# EAGLE design dboardv2 (EAGLE 4.16)
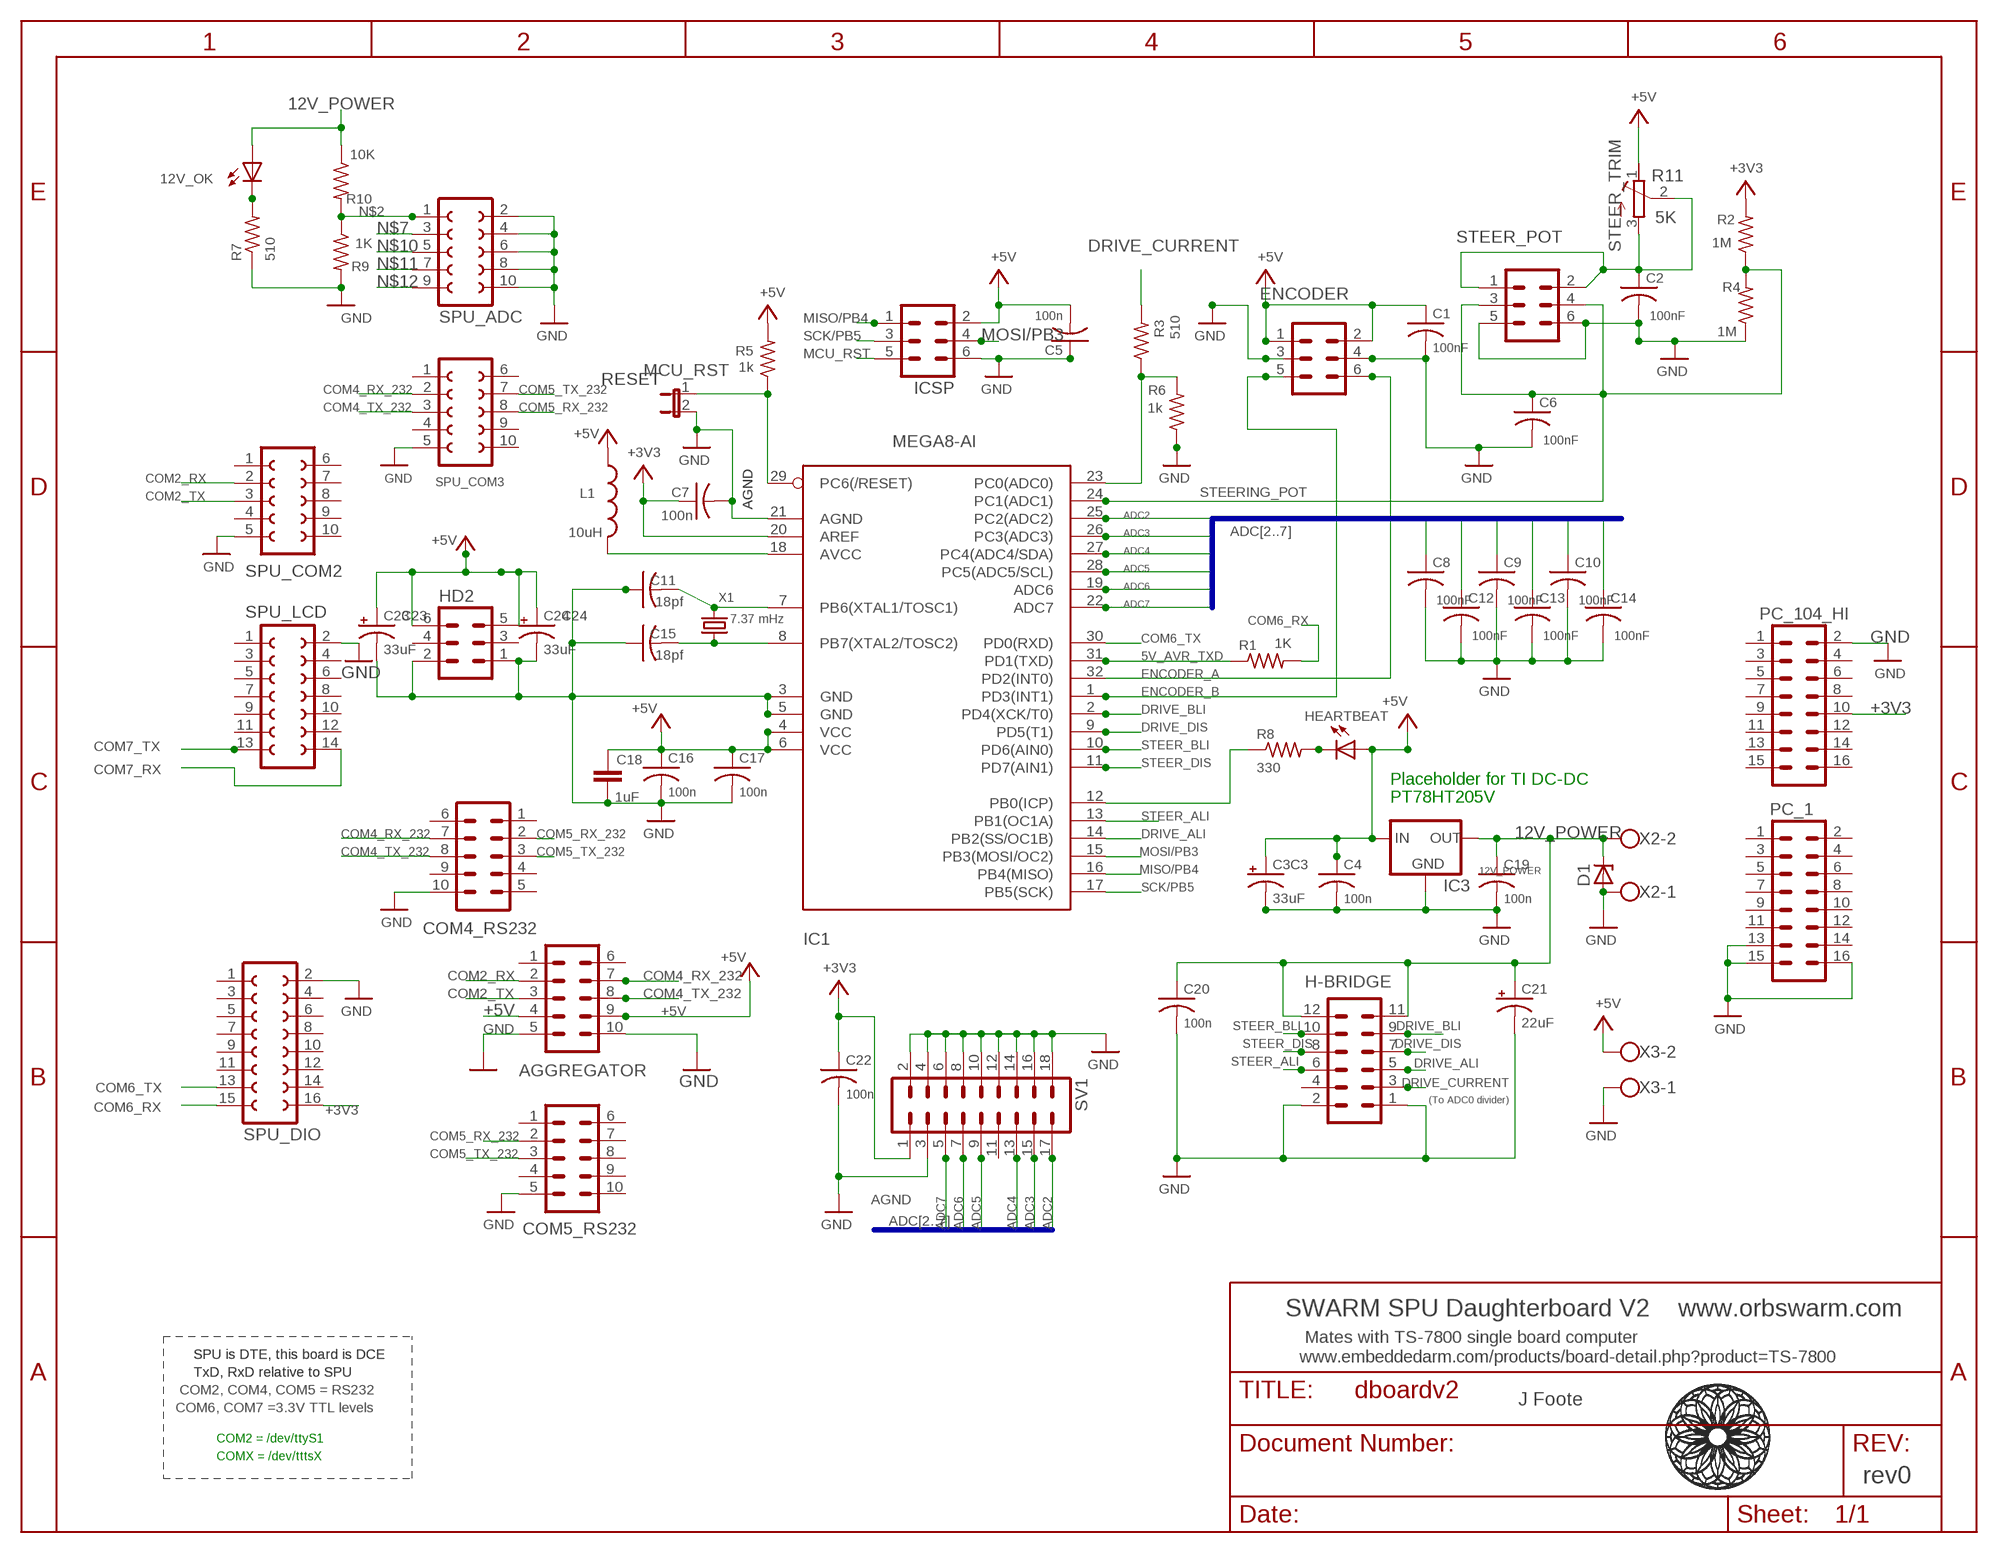
[diagram p0: schematic, sheet 1]

## Parts
12V_OK  LEDSMT1206  [1206]
AGGREGATOR  COMHEADER-M  [MA05-2]
C1  100nF  C-USC1206  [C1206]
C2  100nF  C-USC1206  [C1206]
C3  33uF  CPOL-USCT7343  [CT7343]
C4  100n  C-USC1206  [C1206]
C5  100n  C-USC1206  [C1206]
C6  100nF  C-USC1206  [C1206]
C7  100n  C-USC1206  [C1206]
C8  100nF  C-USC1206  [C1206]
C9  100nF  C-USC1206  [C1206]
C10  100nF  C-USC1206  [C1206]
C11  18pf  C-USC1206  [C1206]
C12  100nF  C-USC1206  [C1206]
C13  100nF  C-USC1206  [C1206]
C14  100nF  C-USC1206  [C1206]
C15  18pf  C-USC1206  [C1206]
C16  100n  C-USC1206  [C1206]
C17  100n  C-USC1206  [C1206]
C18  1uF  C-EUC1206  [C1206]
C19  100n  C-USC1206  [C1206]
C20  100n  C-USC1206  [C1206]
C21  22uF  CPOL-USCT7343  [CT7343]
C22  100n  C-USC1206  [C1206]
C23  33uF  CPOL-USCT7343  [CT7343]
C24  33uF  CPOL-USCT7343  [CT7343]
COM4_RS232  COMHEADER-M  [MA05-2]
COM5_RS232  COMHEADER-M  [MA05-2]
D1  ZENER-DIODEDO41Z10  [DO41Z10]
ENCODER  MA03-2  [MA03-2]
H-BRIDGE  MA06-2  [MA06-2]
HD2  MA03-2  [MA03-2]
HEARTBEAT  LEDSMT1206  [1206]
IC1  MEGA8-AI  [TQFP32-08]
IC3  78XXS  [78XXS]
ICSP  MA03-2  [MA03-2]
L1  10uH  L-USL1812  [L1812]
PC_1  MA08-2  [MA08-2]
PC_104_HI  MA08-2  [MA08-2]
R1  1K  R-US_M1206  [M1206]
R2  1M  R-US_M1206  [M1206]
R3  510  R-US_M1206  [M1206]
R4  1M  R-US_M1206  [M1206]
R5  1k  R-US_M1206  [M1206]
R6  1k  R-US_M1206  [M1206]
R7  510  R-US_M1206  [M1206]
R8  330  R-US_M1206  [M1206]
R9  1K  R-US_M1206  [M1206]
R10  10K  R-US_M1206  [M1206]
R11  5K  R-TRIMM3006P  [RTRIM3006P]
RESET  JP1E  [JP1]
SPU_ADC  FE05-2  [FE05-2]
SPU_COM2  COMHEADER  [FE05-2]
SPU_COM3  COMHEADER  [FE05-2]
SPU_DIO  FE08-2  [FE08-2]
SPU_LCD  FE07-2  [FE07-2]
STEER_POT  MA03-2  [MA03-2]
SV1  MA09-2  [MA09-2]
X1  7.37 mHz  CRYSTALHC49UP  [HC49UP]
X2  W237-102  [W237-102]
X3  W237-102  [W237-102]

## Nets
5V_AVR_TXD: IC1.31(PD1(TXD)) R1.1
12V_POWER: 12V_OK.A C19.1 C20.1 C21.+ D1.C H-BRIDGE.11 H-BRIDGE.12 IC3.OUT R10.1 X2.2
+3V3 [GND]: C7.1 C22.1 IC1.20(AREF) PC_104_HI.10 R2.2 SPU_DIO.16 SV1.1
+5V: AGGREGATOR.4 AGGREGATOR.9 C1.1 C3.+ C4.1 C5.2 C16.1 C17.1 C18.1 C23.+ C24.+ ENCODER.1 ENCODER.2 HD2.5 HD2.6 HEARTBEAT.A IC1.4(VCC) IC1.6(VCC) IC3.IN ICSP.2 L1.1 R5.2 R11.1(A) X3.2
ADC2: C8.1 IC1.25(PC2(ADC2)) SV1.17
ADC3: C12.1 IC1.26(PC3(ADC3)) SV1.15
ADC4: C9.1 IC1.27(PC4(ADC4/SDA)) SV1.13
ADC5: C13.1 IC1.28(PC5(ADC5/SCL)) SV1.9
ADC6: C10.1 IC1.19(ADC6) SV1.7
ADC7: C14.1 IC1.22(ADC7) SV1.5
COM2_RX: AGGREGATOR.2 SPU_COM2.2
COM2_TX: AGGREGATOR.3 SPU_COM2.3
COM4_RX_232: AGGREGATOR.7 COM4_RS232.7 SPU_COM3.2
COM4_TX_232: AGGREGATOR.8 COM4_RS232.8 SPU_COM3.3
COM5_RX_232: COM4_RS232.2 COM5_RS232.2 SPU_COM3.8
COM5_TX_232: COM4_RS232.3 COM5_RS232.3 SPU_COM3.7
COM6_RX: R1.2 SPU_DIO.15
COM6_TX: IC1.30(PD0(RXD)) SPU_DIO.13
COM7_RX: SPU_LCD.14
COM7_TX: SPU_LCD.13
CURRENT_SENSE: IC1.23(PC0(ADC0)) R3.1 R6.2
DRIVE_ALI: H-BRIDGE.5 IC1.14(PB2(SS/OC1B))
DRIVE_BLI: H-BRIDGE.9 IC1.2(PD4(XCK/T0))
DRIVE_CURRENT: H-BRIDGE.3 R3.2
DRIVE_DIS: H-BRIDGE.7 IC1.9(PD5(T1))
ENCODER_A: ENCODER.6 IC1.32(PD2(INT0))
ENCODER_B: ENCODER.5 IC1.1(PD3(INT1))
GND [GND]: AGGREGATOR.5 AGGREGATOR.10 C1.2 C2.2 C3.- C4.2 C5.1 C6.2 C7.2 C8.2 C9.2 C10.2 C11.1 C12.2 C13.2 C14.2 C15.1 C16.2 C17.2 C18.2 C19.2 C20.2 C21.- C22.2 C23.- C24.- COM4_RS232.10 COM5_RS232.5 D1.A ENCODER.3 ENCODER.4 H-BRIDGE.1 H-BRIDGE.2 HD2.1 HD2.2 IC1.3(GND) IC1.5(GND) IC1.21(AGND) IC3.GND ICSP.6 PC_1.13 PC_1.15 PC_1.16 PC_104_HI.2 R4.1 R6.1 R7.1 R9.2 RESET.2 SPU_ADC.2 SPU_ADC.4 SPU_ADC.6 SPU_ADC.8 SPU_ADC.10 SPU_COM2.5 SPU_COM3.5 SPU_DIO.2 SPU_LCD.2 STEER_POT.5 STEER_POT.6 SV1.2 SV1.3 SV1.4 SV1.6 SV1.8 SV1.10 SV1.12 SV1.14 SV1.16 SV1.18 X2.1 X3.1
MCU_RST: IC1.29(PC6(/RESET)) ICSP.5 R5.1 RESET.1
MISO/PB4: IC1.16(PB4(MISO)) ICSP.1
MOSI/PB3: IC1.15(PB3(MOSI/OC2)) ICSP.4
N$1: IC1.12(PB0(ICP)) R8.1
N$2: R9.1 R10.2 SPU_ADC.1
N$3: HEARTBEAT.C R8.2
N$4 [GND]: C11.2 IC1.7(PB6(XTAL1/TOSC1)) X1.2
N$5: IC1.18(AVCC) L1.2
N$7: SPU_ADC.3
N$9 [GND]: C15.2 IC1.8(PB7(XTAL2/TOSC2)) X1.1
N$10: SPU_ADC.5
N$11: SPU_ADC.7
N$12: SPU_ADC.9
N$16: 12V_OK.C R7.2
SCK/PB5: IC1.17(PB5(SCK)) ICSP.3
STEER_ALI: H-BRIDGE.6 IC1.13(PB1(OC1A))
STEER_BLI [GND]: H-BRIDGE.10 IC1.10(PD6(AIN0))
STEER_DIS: H-BRIDGE.8 IC1.11(PD7(AIN1))
STEER_TRIM [GND]: C2.1 R11.2(S) R11.3(E) STEER_POT.1 STEER_POT.2
STEERING_POT: C6.1 IC1.24(PC1(ADC1)) R2.1 R4.2 STEER_POT.3 STEER_POT.4
Unconnected: AGGREGATOR.1 AGGREGATOR.6 COM4_RS232.1 COM4_RS232.4 COM4_RS232.5 COM4_RS232.6 COM4_RS232.9 COM5_RS232.1 COM5_RS232.4 COM5_RS232.6 COM5_RS232.7 COM5_RS232.8 COM5_RS232.9 COM5_RS232.10 H-BRIDGE.4 HD2.3 HD2.4 PC_1.1 PC_1.2 PC_1.3 PC_1.4 PC_1.5 PC_1.6 PC_1.7 PC_1.8 PC_1.9 PC_1.10 PC_1.11 PC_1.12 PC_1.14 PC_104_HI.1 PC_104_HI.3 PC_104_HI.4 PC_104_HI.5 PC_104_HI.6 PC_104_HI.7 PC_104_HI.8 PC_104_HI.9 PC_104_HI.11 PC_104_HI.12 PC_104_HI.13 PC_104_HI.14 PC_104_HI.15 PC_104_HI.16 SPU_COM2.1 SPU_COM2.4 SPU_COM2.6 SPU_COM2.7 SPU_COM2.8 SPU_COM2.9 SPU_COM2.10 SPU_COM3.1 SPU_COM3.4 SPU_COM3.6 SPU_COM3.9 SPU_COM3.10 SPU_DIO.1 SPU_DIO.3 SPU_DIO.4 SPU_DIO.5 SPU_DIO.6 SPU_DIO.7 SPU_DIO.8 SPU_DIO.9 SPU_DIO.10 SPU_DIO.11 SPU_DIO.12 SPU_DIO.14 SPU_LCD.1 SPU_LCD.3 SPU_LCD.4 SPU_LCD.5 SPU_LCD.6 SPU_LCD.7 SPU_LCD.8 SPU_LCD.9 SPU_LCD.10 SPU_LCD.11 SPU_LCD.12 SV1.11

## Buses
ADC[2..7]

## Notes on the sheet
- AGND | AGND
- Placeholder for TI DC-DC
- PT78HT205V
- (To ADC0 divider)
- AGND
- SWARM SPU Daughterboard V2 | www.orbswarm.com
- Mates with TS-7800 single board computer
- SPU is DTE, this board is DCE | SPU is DTE, this board is DCE | www.embeddedarm.com/products/board-detail.php?product=TS-7800
- TxD, RxD relative to SPU | TxD, RxD relative to SPU
- COM2, COM4, COM5 = RS232
- J Foote
- COM6, COM7 =3.3V TTL levels
- COM2 = /dev/ttyS1
- COMX = /dev/tttsX
- rev0

## Library data of the parts
12V_OK HEARTBEAT = led:LED: LED OSRAM: - CHIPLED LG R971, LG N971, LY N971, LG Q971, LY Q971, LO R971, LY R971 LH N974, LH R974 LS Q976, LO Q976, LY Q976 LO Q996 - Hyper CHIPLED LW Q18S LB Q993, LB Q99A, LB R99A - SideLED LS A670, LO A670, LY A670, LG A670, LP A670 LB A673, LV A673, LT A673, LW A673 LH A674 LY A675 LS A676, LA A676, LO A676, LY A676, LW A676 LS A679, LY A679, LG A679 - Hyper Micro SIDELED® LS Y876, LA Y876, LO Y876, LY Y876 LT Y87S - SmartLED LW L88C, LW L88S LB L89C, LB L89S, LG L890 LS L89K, LO L89K, LY L89K LS L896, LA L896, LO L896, LY L896 - TOPLED LS T670, LO T670, LY T670, LG T670, LP T670 LSG T670, LSP T670, LSY T670, LOP T670, LYG T670 LG T671, LOG T671, LSG T671 LB T673, LV T673, LT T673, LW T673 LH T674 LS T676, LA T676, LO T676, LY T676, LB T676, LH T676, LSB T676, LW T676 LB T67C, LV T67C, LT T67C, LS T67K, LO T67K, LY T67K, LW E67C LS E67B, LA E67B, LO E67B, LY E67B, LB E67C, LV E67C, LT E67C LW T67C LS T679, LY T679, LG T679 LS T770, LO T770, LY T770, LG T770, LP T770 LB T773, LV T773, LT T773, LW T773 LH T774 LS E675, LA E675, LY E675, LS T675 LS T776, LA T776, LO T776, LY T776, LB T776 LHGB T686 LT T68C, LB T68C - Hyper Mini TOPLED® LB M676 - Mini TOPLED Santana® LG M470 LS M47K, LO M47K, LY M47K Source: http://www.osram.convergy.de - LUMILED® LXK2-PW12-R00, LXK2-PW12-S00, LXK2-PW14-U00, LXK2-PW14-V00 LXK2-PM12-R00, LXK2-PM12-S00, LXK2-PM14-U00 LXK2-PE12-Q00, LXK2-PE12-R00, LXK2-PE12-S00, LXK2-PE14-T00, LXK2-PE14-U00 LXK2-PB12-K00, LXK2-PB12-L00, LXK2-PB12-M00, LXK2-PB14-N00, LXK2-PB14-P00, LXK2-PB14-Q00 LXK2-PR12-L00, LXK2-PR12-M00, LXK2-PR14-Q00, LXK2-PR14-R00 LXK2-PD12-Q00, LXK2-PD12-R00, LXK2-PD12-S00 LXK2-PH12-R00, LXK2-PH12-S00 LXK2-PL12-P00, LXK2-PL12-Q00, LXK2-PL12-R00 Source: www.luxeon.com
AGGREGATOR COM4_RS232 COM5_RS232 = foote:COMHEADER-M
C1 C2 C4-C17 C19 C20 C22 = rcl:C-US: CAPACITOR, American symbol
C3 C21 C23 C24 = rcl:CPOL-US: POLARIZED CAPACITOR, American symbol
C18 = rcl:C-EU: CAPACITOR, European symbol
D1 = diode:ZENER-DIODE: Z-Diode
ENCODER HD2 ICSP STEER_POT = con-lstb:MA03-2: PIN HEADER
H-BRIDGE = con-lstb:MA06-2: PIN HEADER
IC1 = atmel:MEGA8: MICROCONTROLLER 8 Kbytes FLASH 1 kbytes SRAM 512 bytes EEPROM USART 6-channel 10 bit ADC 2-channel 8 bit ADC Source: avr.lbr
IC3 = v-reg:78XXS: VOLTAGE REGULATOR
L1 = rcl:L-US: INDUCTOR, American symbol
PC_1 PC_104_HI = con-lstb:MA08-2: PIN HEADER
R1-R10 = rcl:R-US_: RESISTOR, American symbol
R11 = rcl:R-TRIMM: Trimm resistor
RESET = jumper:JP1E: JUMPER
SPU_ADC = con-lsta:FE05-2: FEMALE HEADER
SPU_COM2 SPU_COM3 = foote:COMHEADER
SPU_DIO = con-lsta:FE08-2: FEMALE HEADER
SPU_LCD = con-lsta:FE07-2: FEMALE HEADER
SV1 = con-lstb:MA09-2: PIN HEADER
X1 = crystal:CRYSTAL: CRYSTAL
X2 X3 = con-wago-500:W237-102: WAGO SCREW CLAMP

## Board
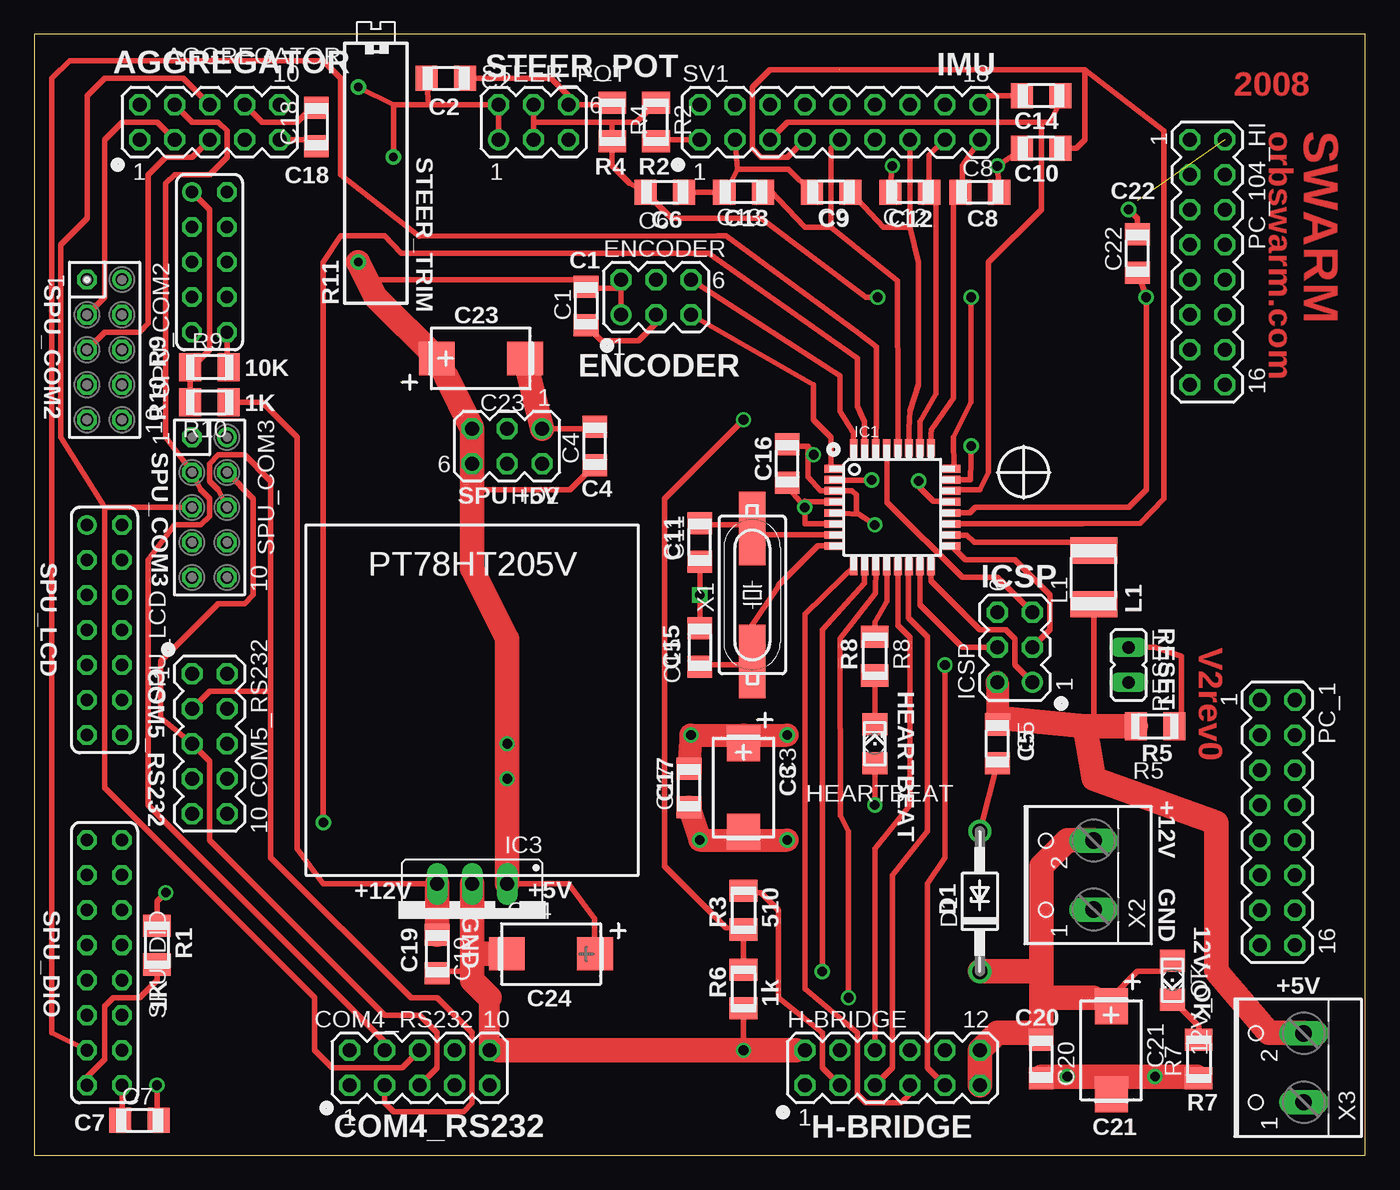
[diagram p1: board, top side]
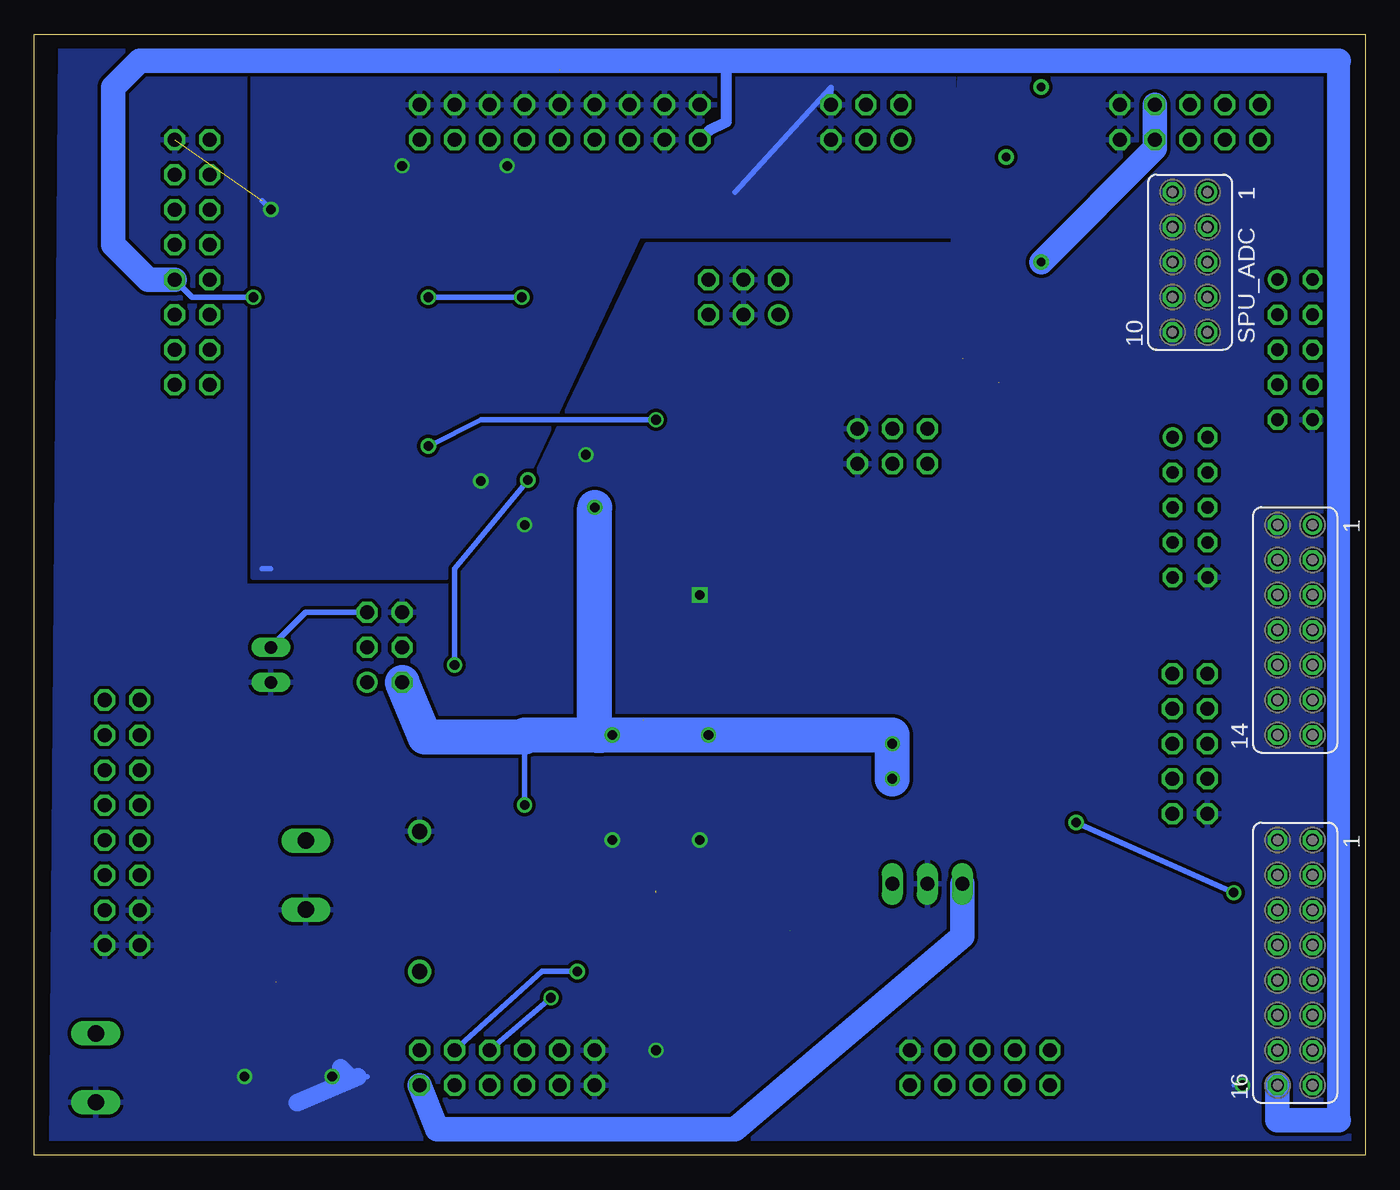
[diagram p2: board, bottom side, seen from below]

Size 96.52 x 81.28 mm. Coordinates in mm from the lower left corner, seen from the top.
Outline: 0,0 96.52,0 96.52,81.28 0,81.28 0,0
Copper layers (1*16): Top 0.035mm / dielectric 1.5mm / Bottom 0.035mm
Design rules "default": minimum track width 10mil, minimum drill 24mil, track to track 8mil, track to pad 8mil, pad to pad 8mil, via to via 8mil, smd to smd 8mil, copper to edge 40mil, drill to drill 8mil, minimum pad ring 10mil, minimum via ring 8mil, stop-mask expansion 4mil, vias tented up to drill 0mil, thermal gap 10mil

### Footprints (pad centres in the part's own frame; a part is rotated, then mirrored left to right if it is on the bottom)
1206 = smd 1.6 x 1.803: A -1.422,0; C 1.422,0
MA05-2 = drill 1.016 octagon: 1 -5.08,-1.27; 2 -2.54,-1.27; 3 0,-1.27; 4 2.54,-1.27; 5 5.08,-1.27; 6 -5.08,1.27; 7 -2.54,1.27; 8 0,1.27; 9 2.54,1.27; 10 5.08,1.27
C1206 = smd 1.6 x 1.8: 1 -1.4,0; 2 1.4,0
CT7343 = smd 2.6 x 2.4: + 3.2,0; - -3.2,0
DO41Z10 = drill 1.118 round: A 5.08,0; C -5.08,0
MA03-2 = drill 1.016 round: 1 -2.54,-1.27 | drill 1.016 octagon: 2 -2.54,1.27; 3 0,-1.27; 4 0,1.27; 5 2.54,-1.27; 6 2.54,1.27
MA06-2 = drill 1.016 octagon: 1 -6.35,-1.27; 2 -6.35,1.27; 3 -3.81,-1.27; 4 -3.81,1.27; 5 -1.27,-1.27; 6 -1.27,1.27; 7 1.27,-1.27; 8 1.27,1.27; 9 3.81,-1.27; 10 3.81,1.27; 11 6.35,-1.27; 12 6.35,1.27
TQFP32-08 = smd 1.27 x 0.559: 1 -4.293,2.8; 2 -4.293,2; 3 -4.293,1.2; 4 -4.293,0.4; 5 -4.293,-0.4; 6 -4.293,-1.2; 7 -4.293,-2; 8 -4.293,-2.8; 17 4.293,-2.8; 18 4.293,-2; 19 4.293,-1.2; 20 4.293,-0.4; 21 4.293,0.4; 22 4.293,1.2; 23 4.293,2; 24 4.293,2.8 | smd 0.559 x 1.27: 9 -2.8,-4.293; 10 -2,-4.293; 11 -1.2,-4.293; 12 -0.4,-4.293; 13 0.4,-4.293; 14 1.2,-4.293; 15 2,-4.293; 16 2.8,-4.293; 25 2.8,4.293; 26 2,4.293; 27 1.2,4.293; 28 0.4,4.293; 29 -0.4,4.293; 30 -1.2,4.293; 31 -2,4.293; 32 -2.8,4.293
78XXS = drill 1.016 long: GND 0,-2.54; IN -2.54,-2.54; OUT 2.54,-2.54
L1812 = smd 1.9 x 3.4: 1 -1.95,0; 2 1.95,0
MA08-2 = drill 1.016 octagon: 1 -8.89,-1.27; 2 -8.89,1.27; 3 -6.35,-1.27; 4 -6.35,1.27; 5 -3.81,-1.27; 6 -3.81,1.27; 7 -1.27,-1.27; 8 -1.27,1.27; 9 1.27,-1.27; 10 1.27,1.27; 11 3.81,-1.27; 12 3.81,1.27; 13 6.35,-1.27; 14 6.35,1.27; 15 8.89,-1.27; 16 8.89,1.27
M1206 = smd 1.6 x 2: 1 -1.4,0; 2 1.4,0
RTRIM3006P = drill 0.61 round: 1 -7.62,1.27; 2 0,-1.27; 3 5.08,1.27
JP1 = drill 0.914 long: 1 0,-1.27; 2 0,1.27
FE05-2 = drill 0.914 round: 1 -5.08,1.27 | drill 0.914 octagon: 2 -5.08,-1.27; 3 -2.54,1.27; 4 -2.54,-1.27; 5 0,1.27; 6 0,-1.27; 7 2.54,1.27; 8 2.54,-1.27; 9 5.08,1.27; 10 5.08,-1.27
FE05-2' = drill 0.914 octagon: 1 -5.08,-1.27; 2 -2.54,-1.27; 3 0,-1.27; 4 2.54,-1.27; 5 5.08,-1.27; 7 -2.54,1.27; 8 0,1.27; 9 2.54,1.27; 10 5.08,1.27 | drill 0.914 round: 6 -5.08,1.27
FE08-2 = drill 0.914 octagon: 1 -8.89,1.27; 2 -8.89,-1.27; 3 -6.35,1.27; 4 -6.35,-1.27; 5 -3.81,1.27; 6 -3.81,-1.27; 7 -1.27,1.27; 8 -1.27,-1.27; 9 1.27,1.27; 10 1.27,-1.27; 11 3.81,1.27; 12 3.81,-1.27; 13 6.35,1.27; 14 6.35,-1.27; 15 8.89,1.27; 16 8.89,-1.27
FE07-2 = drill 0.914 round: 1 -7.62,1.27 | drill 0.914 octagon: 2 -7.62,-1.27; 3 -5.08,1.27; 4 -5.08,-1.27; 5 -2.54,1.27; 6 -2.54,-1.27; 7 0,1.27; 8 0,-1.27; 9 2.54,1.27; 10 2.54,-1.27; 11 5.08,1.27; 12 5.08,-1.27; 13 7.62,1.27; 14 7.62,-1.27
MA09-2 = drill 1.016 octagon: 1 -10.16,-1.27; 2 -10.16,1.27; 3 -7.62,-1.27; 4 -7.62,1.27; 5 -5.08,-1.27; 6 -5.08,1.27; 7 -2.54,-1.27; 8 -2.54,1.27; 9 0,-1.27; 10 0,1.27; 11 2.54,-1.27; 12 2.54,1.27; 13 5.08,-1.27; 14 5.08,1.27; 15 7.62,-1.27; 16 7.62,1.27; 17 10.16,-1.27; 18 10.16,1.27
HC49UP = smd 5.334 x 1.93: 1 -4.826,0; 2 4.826,0
W237-102 = drill 1.194 long: 1 -2.5,-1.27; 2 2.5,-1.27

### Placement (x,y rotation side)
12V_OK  82.55,12.7 270 top
AGGREGATOR  12.7,74.93 0 top
C1  40.01,61.59 270 top
C2  29.84,78.11 0 top
C3  51.44,26.67 90 top
C4  40.64,51.44 90 top
C5  69.85,29.84 90 top
C6  45.72,69.85 0 top
C7  7.62,2.54 0 top
C8  68.58,69.85 0 top
C9  57.78,69.85 180 top
C10  73.03,73.03 180 top
C11  48.26,44.45 90 top
C12  63.5,69.85 180 top
C13  51.44,69.85 180 top
C14  73.03,76.83 180 top
C15  48.26,36.83 270 top
C16  54.61,50.16 90 top
C17  47.47,26.64 270 top
C18  20.45,74.57 270 top
C19  29.21,14.61 270 top
C20  73.03,6.99 270 top
C21  78.11,7.62 90 top
C22  80.01,65.41 90 top
C23  32.38,57.78 180 top
C24  37.47,14.61 0 top
COM4_RS232  27.94,6.35 0 top
COM5_RS232  12.7,29.84 270 top
D1  68.58,18.41 90 top
ENCODER  45.09,62.23 0 top
H-BRIDGE  62.23,6.35 0 top
HD2  34.29,51.44 180 top
HEARTBEAT  60.96,29.84 90 top
IC1  62.23,46.99 0 top
IC3  31.75,17.14 180 top
ICSP  71.12,36.83 90 top
L1  76.83,41.91 90 top
PC_1  90.17,24.13 270 top
PC_104_HI  85.09,64.77 270 top
R1  8.89,15.24 270 top
R2  45.09,74.93 270 top
R3  51.44,17.78 90 top
R4  41.91,74.93 270 top
R5  81.28,31.11 180 top
R6  51.44,12.06 90 top
R7  84.45,6.99 90 top
R8  60.96,36.2 270 top
R9  12.7,57.15 0 top
R10  12.7,54.61 180 top
R11  24.77,72.39 90 top
RESET  79.38,35.56 180 top
SPU_ADC  12.7,64.77 270 bottom
SPU_COM2  [FE05-2']  5.08,58.42 270 top
SPU_COM3  [FE05-2']  12.7,46.99 270 top
SPU_DIO  5.08,13.97 270 bottom
SPU_LCD  5.08,38.1 270 bottom
STEER_POT  36.2,74.93 0 top
SV1  58.42,74.93 0 top
X1  52.07,40.64 90 top
X2  75.56,20.32 90 top
X3  90.81,6.35 90 top

### Tracks (layer width: path | path; a pad name or v marks a point on that pad's centre or on a via)
5V_AVR_TXD  (via drill 0.7)
  Top 0.406: IC1.31 60.2,51.33 60.2,53.19 59.69,54.33 59.69,57.78 48.9,65.41 26.58,65.41 25.4,66.67 22.23,66.67 20.95,64.77 v20.95,24.13 | R1.1 8.89,18.41 v9.53,19.05
  Bottom 0.406: v9.53,19.05 v20.95,24.13
12V_POWER
  Top 0.406: C21.+ 77.47,11.43 | 78.06,11.43 78.11,10.84 C21.+ | 78.06,11.43 76.81,11.43 C21.+ | 73.04,13.34 73.66,13.34 | R10.1 16.51,54.61 19.05,52.07 19.05,22.23 20.95,19.68 IC3.OUT | 76.8,22.86 X2.2 | 73.04,13.34 73.03,13.34 | 73.04,13.34 | 73.03,8.89 C20.1 | 12V_OK.A 81.76,13.34 80.01,13.34 78.11,11.43 78.06,11.43
  Top 1.778: 73.03,11.43 73.04,13.34 | 73.03,11.43 76.81,11.43 | 73.03,11.43 73.03,8.89 69.85,8.89 H-BRIDGE.12 H-BRIDGE.11 | D1.C 73.03,13.34 73.03,20.95 74.93,22.86 76.8,22.86 | IC3.OUT C19.1
  Bottom 1.778: IC3.OUT 29.21,15.88 45.72,1.91 67.31,1.91 H-BRIDGE.11
+3V3  (via drill 0.7)
  Top 0.406: IC1.20 67.84,46.58 68.25,46.99 79.38,46.99 80.64,48.26 v80.64,62.23 80.01,64.14 C22.1 | C7.1 6.35,2.67 SPU_DIO.16 | R2.2 45.22,73.66 SV1.1
  Bottom 0.406: 46.35,79.38 48.26,80.01 | 47.62,74.3 SV1.1 | v80.64,62.23 85.09,62.23 PC_104_HI.10
  Bottom 0.813: 46.35,79.38 46.35,74.93 47.62,74.3
  Bottom 1.676: 1.91,2.54 1.91,79.38
  Bottom 1.778: 21.59,79.38 1.91,79.38 46.35,79.38 88.9,79.38 90.81,77.47 90.81,66.04 88.27,63.5 PC_104_HI.10 | 1.91,2.54 6.35,2.54 SPU_DIO.16
+5V  (via drill 0.7)  (1 unrouted)
  Top 0.406: 69.85,31.75 C5.2 69.98,31.11 | IC1.4 57.3,47.4 55.85,47.4 55.88,47.42 v55.88,46.99 | C16.1 54.66,48.46 v55.88,46.99 | 47.49,28.57 C17.1 | 76.2,31.11 76.83,31.75 76.83,39.37 76.88,40.01 L1.1 | v60.96,25.4 HEARTBEAT.A 60.96,28.57 | IC1.6 55.88,45.79 v55.88,46.99 | 51.44,29.21 C3.+ 51.44,30.48 | HD2.6 HD2.5 | 29.84,57.78 29.84,56.52 29.84,57.15 | AGGREGATOR.9 16.51,74.93 19.05,74.93 20.32,76.2 20.32,76.1 C18.1 | 92.03,8.89 X3.2 | 42.55,62.87 ENCODER.1 | 42.55,62.87 ENCODER.2 | 42.55,62.87 40.01,62.87 C1.1 39.5,63.5 24.77,63.5 R11.1 | IC3.IN 38.73,19.68 40.64,17.14 40.64,14.61 C24.+ | C4.1 38.87,48.26 31.75,48.26
  Top 1.676: v54.61,30.48 51.44,30.48 v47.62,30.48 47.49,28.57 | ICSP.2 69.85,31.75
  Top 1.778: 69.85,31.75 76.2,31.11 | 76.2,31.11 76.83,27.3 85.72,24.13 85.72,13.34 89.53,8.89 92.03,8.89 | IC3.IN v34.29,27.3 v34.29,29.84 34.29,37.47 31.75,42.55 31.75,48.26 HD2.6 HD2.5 | HD2.5 29.84,56.52 | 76.2,31.11 R5.2 | R11.1 24.77,62.23 29.21,57.78 HD2.5
  Bottom 0.406: AGGREGATOR.4 AGGREGATOR.9 | 60.96,30.33 v60.96,25.4
  Bottom 1.778: AGGREGATOR.9 AGGREGATOR.4 15.24,73.03 R11.1
  Bottom 2.54: ICSP.2 68.2,30.33 60.96,30.33 60.96,30.48 55.88,30.48 | 55.88,30.48 55.24,30.48 | 55.88,30.48 v47.62,30.48 34.29,30.48 v34.29,29.84 v34.29,27.3 | 55.88,30.48 v55.88,46.99
+5V1  (1 unrouted)
+5V2  (1 unrouted)
+5V3  (1 unrouted)
+5V4  (1 unrouted)
ADC2
  Top 0.406: IC1.25 65.02,52.25 65.05,52.63 66.67,54.91 66.67,69.85 arc270 66.55,69.98 C8.1 67.31,70.48 67.31,71.75 SV1.17
ADC3
  Top 0.406: IC1.26 64.24,52.45 64.24,53.19 65.41,55.24 65.41,69.85 64.77,70.48 C12.1 64.9,72.52 SV1.15
ADC4
  Top 0.406: IC1.27 63.45,52.68 63.5,53.98 64.14,55.88 64.14,64.77 63.5,67.31 | 63.5,67.31 61.59,67.31 59.69,69.34 C9.1 | 63.5,67.31 SV1.13
ADC5
  Top 0.406: IC1.28 62.64,52.91 62.64,53.75 62.61,63.42 57.78,67.31 | C13.1 53.34,69.98 55.88,67.31 57.78,67.31 | 57.78,67.31 57.78,73.03 SV1.9
ADC6  (1 unrouted)
  Top 0.406: IC1.19 76,45.8 80.21,45.85 81.92,47.62 81.92,74.3 76.2,78.74 | 76.2,78.74 72.39,78.74 58.44,78.72 | 58.4,78.74 53.34,78.74 52.07,77.47 52.07,73.03 52.7,72.39 54.61,72.39 SV1.7 | C10.1 75.56,73.03 76.2,73.66 76.2,78.74
ADC7
  Top 0.406: IC1.22 66.59,48.26 68.58,48.26 69.22,49.53 69.22,64.77 73.03,68.58 73.03,74.93 | 73.03,74.93 54.61,74.93 SV1.5 | C14.1 74.3,76.2 73.66,74.93 73.03,74.93
COM2_RX
  Top 0.406: SPU_COM2.2 5.08,62.23 5.08,73.66 6.35,74.93 8.89,74.93 AGGREGATOR.2
COM2_TX
  Top 0.406: AGGREGATOR.3 11.43,72.39 9.53,72.39 8.26,71.12 8.26,60.33 7.62,59.69 5.08,59.69 SPU_COM2.3
COM4_RX_232
  Top 0.406: COM4_RS232.7 25.4,8.26 8.26,25.4 8.26,43.18 10.16,45.72 12.06,45.72 12.7,46.35 12.7,47.62 12.06,48.26 SPU_COM3.2 9.53,52.07 9.53,70.48 10.16,71.12 12.7,71.12 13.97,72.39 13.97,74.3 13.34,74.93 11.43,74.93 AGGREGATOR.7
COM4_TX_232
  Top 0.406: COM4_RS232.8 26.67,6.35 21.59,6.35 20.32,7.62 20.32,11.43 5.08,26.67 5.08,46.99 | 5.08,46.99 SPU_COM3.3 | AGGREGATOR.8 10.79,78.11 5.08,78.11 3.81,76.83 3.81,67.94 1.91,66.04 1.91,52.07 5.08,46.99
COM5_RX_232
  Top 0.406: COM4_RS232.2 25.4,3.81 26.04,3.17 31.11,3.17 31.75,3.81 31.75,8.89 29.21,11.43 27.3,11.43 17.14,21.59 17.14,33.66 | 17.14,33.66 12.7,33.66 COM5_RS232.2 | SPU_COM3.8 13.34,48.26 12.7,48.9 12.7,50.16 13.34,50.8 15.24,50.8 17.14,48.9 17.14,33.66
COM5_TX_232
  Top 0.406: COM4_RS232.3 29.21,6.35 29.21,8.89 27.94,10.16 25.4,10.16 12.7,22.86 12.7,28.57 COM5_RS232.3 9.14,31.75 9.14,35.81 13.34,40.01 15.24,40.01 15.88,40.64 15.88,47.62 SPU_COM3.7
COM6_RX
  Top 0.406: SPU_DIO.15 3.81,5.71 5.08,6.99 5.08,10.79 5.71,11.43 7.62,11.43 8.89,12.7 R1.2
COM6_TX
  Top 0.406: IC1.30 61.06,54.08 61.06,58.65 59.69,59.69 50.16,66.67 49.53,66.67 27.91,66.64 22.23,71.09 22.23,78.11 20.95,79.38 2.54,79.38 1.27,78.11 1.27,8.89 SPU_DIO.13
CURRENT_SENSE  (via drill 0.7)
  Top 0.406: IC1.23 67.89,49 67.94,50.32 v67.94,51.44 | v51.44,53.34 45.72,47.62 45.72,20.95 50.16,16.51 R3.1 R6.2 | R6.2 50.8,13.34 51.44,13.34 R6.2
  Bottom 0.406: v51.44,53.34 64.14,53.34 v67.94,51.44
DRIVE_ALI
  Top 0.406: IC1.14 63.4,42.67 63.4,38.99 64.77,37.62 64.77,23.5 62.23,20.32 62.23,6.35 H-BRIDGE.5
DRIVE_BLI  (via drill 0.7)
  Top 0.406: 58.95,48.97 IC1.2 | v60.73,48.97 58.95,48.97 | 58.95,48.97 58.84,48.97 | H-BRIDGE.9 64.77,6.35 64.77,19.68 66.04,21.59 v66.04,35.56
  Bottom 0.406: v60.73,48.97 66.04,42.55 v66.04,35.56
DRIVE_CURRENT  (1 unrouted)
  Top 0.406: H-BRIDGE.3 57.15,6.35 57.15,8.89 53.98,11.43 53.98,17.78 52.7,19.05 51.44,19.05
DRIVE_DIS
  Top 0.406: H-BRIDGE.7 63.5,4.45 62.87,3.81 60.33,3.81 59.69,4.45 59.69,8.89 55.88,12.06 55.91,39.24 58.64,41.91 IC1.9
ENCODER_A
  Top 0.406: IC1.32 59.41,52.4 58.42,53.98 58.42,56.52 ENCODER.6
ENCODER_B
  Top 0.406: IC1.1 57.78,49.94 57.78,52.07 56.52,53.34 56.52,55.88 ENCODER.5
GND  (via drill 0.7)  (1 unrouted)
  Top 0.406: C15.1 v48.26,40.64 C11.1 48.26,43.18 | D1.A C5.1 | IC1.5 59.79,46.51 v60.96,45.72 59.61,46.58 59.61,47.9 59.31,48.21 IC1.3 57,48.19 56.12,49.22 56.11,49.74 56.11,51.44 | IC1.21 66.49,47.42 65.23,47.42 64.14,48.51 v64.14,48.9 | 55.24,51.44 C16.2 | 55.24,51.44 54.61,51.44 | 56.11,51.44 55.24,51.44 | 56.11,51.44 v56.52,50.8 | R6.1 51.43,11.04 v51.44,7.62 | 80.64,5.71 v81.28,5.71 81.66,5.71 | C20.2 73.03,5.71 | 78.11,5.71 C21.- | C3.- 50.8,23.47 50.8,22.86 | 62.23,70.48 C12.2 62.1,70.48 v62.23,71.75 | R9.2 13.97,57.15 SPU_ADC.10 | 35.56,57.78 C23.- | C8.2 69.85,70.48 | C2.2 37.47,78.11 38.73,76.83 STEER_POT.6 41.78,76.2 R4.1 | C18.2 20.32,73.3 20.32,73.66 AGGREGATOR.5 | COM4_RS232.10 33.66,7.62 | 55.24,7.62 H-BRIDGE.2 | C1.2 41.15,59.05 43.81,59.05 45.09,60.33 ENCODER.3 | C7.2 8.89,2.67 v8.89,5.08 | C4.2 40.64,52.7 HD2.1 | C19.2 28.7,13.34 31.75,13.34 | 84.33,5.71 R7.1 | 71.12,76.2 C14.2 69.22,76.83 SV1.18 | C9.2 54.68,71.5 51,71.5 | 50.16,69.85 C13.2 C6.2 50.16,69.85 | 50.16,69.85 51,71.5 | 51,71.5 SV1.3 | C10.2 71.75,73.03 v69.85,71.75 C8.2 | C8.2 69.85,69.85 | C22.2 80.01,67.94 v79.38,68.58
  Top 1.524: COM4_RS232.10 33.02,11.43
  Top 1.676: v54.61,22.86 50.8,22.86 v48.26,22.86 C17.2
  Top 1.778: 73.03,5.71 v74.93,5.71 78.11,5.71 80.64,5.71 84.33,5.71 | HD2.1 35.56,57.78 | 31.75,14.61 31.75,13.34 31.75,12.7 33.02,11.43 | 31.75,14.61 IC3.GND | 33.66,7.62 55.24,7.62 | 31.75,14.61 C24.-
  Bottom 0.305: v8.89,5.08 9.53,5.08
  Bottom 0.406: 72.39,5.71 73.03,5.71 73.66,5.71 | STEER_POT.6 38.73,77.47 45.72,69.85 | 79.38,42.55 80.01,42.55 | v79.38,68.58 80.01,69.22
  Bottom 1.27: 73.66,5.71 74.3,6.35 | 73.03,5.71 77.47,3.81
  pour Bottom (isolate 0.254, rank 2): 95.25,0.64 0.64,0.64 0.64,80.64 29.21,80.64 29.84,71.75 29.84,66.04 52.07,66.04 60.33,48.9 66.67,41.27 81.28,41.27 81.28,80.64 94.61,80.64
  pour Bottom (isolate 0.254): 80.64,80.64 80.64,41.91 66.67,41.91 60.96,48.9 52.7,66.67 29.84,66.67 29.84,80.64
MCU_RST
  Top 0.406: ICSP.5 69.85,41.91 67.31,41.91 61.85,47.37 61.85,50.62 61.83,50.63 IC1.29 | RESET.1 81.28,36.83 83.19,36.2 83.19,30.48 R5.1
  Bottom 0.406: ICSP.5 76.83,39.37 RESET.1
MISO/PB4
  Top 0.406: IC1.16 65.03,41.65 68.58,38.1 70.48,38.1 71.12,37.47 71.12,35.56 ICSP.1
MOSI/PB3
  Top 0.406: IC1.15 64.23,39.91 67.31,36.83 ICSP.4
N$1
  Top 0.406: IC1.12 61.85,42.68 61.85,40.18 60.96,38.66 R8.1 60.96,37.47
N$2
  Top 0.406: SPU_ADC.1 12.7,68.58 12.7,58.42 11.43,57.15 R9.1 11.3,54.74 11.43,54.61 R10.2
N$3
  Top 0.406: HEARTBEAT.C R8.2
N$4
  Top 0.406: X1.2 51.44,45.72 47.76,45.72 C11.2 | X1.2 52.3,45.01 | IC1.7 52.07,44.99 X1.2
N$5
  Top 0.406: IC1.18 67.64,44.98 68.17,44.45 76.83,44.45 L1.2
N$9
  Top 0.406: C15.2 47.76,35.56 51.44,35.56 X1.1 51.82,38.1 53.98,41.27 53.98,41.33 56.84,44.2 IC1.8
N$16
  Top 0.406: 84.45,8.26 R7.2 84.45,9.37 12V_OK.C
SCK/PB5
  Top 0.406: ICSP.3 73.66,38.1 73.66,40.64 71.12,43.18 67.53,43.18 IC1.17
STEER_ALI
  Top 0.406: IC1.13 62.64,38.43 63.5,37.57 63.5,25.4 60.96,22.23 H-BRIDGE.6
STEER_BLI  (via drill 0.7)
  Top 0.406: IC1.10 60.2,42.66 60.2,41.48 57.15,38.1 v57.15,13.34
  Bottom 0.406: v57.15,13.34 59.69,13.34 H-BRIDGE.10
STEER_DIS  (via drill 0.7)
  Top 0.406: IC1.11 61.01,40.77 58.42,37.47 58.42,37.29 58.47,24.64 59.05,23.5 v59.05,11.43
  Bottom 0.406: v59.05,11.43 H-BRIDGE.8
STEER_TRIM
  Top 0.406: 28.57,76.2 C2.1 | 28.57,76.2 STEER_POT.2 STEER_POT.1 | 26.04,76.2 28.57,76.2 | R11.2 26.04,76.2 | 26.04,76.2 R11.3
STEERING_POT  (via drill 0.7)
  Top 0.406: v61.16,62.23 60.33,62.23 52.7,67.94 46.23,67.94 C6.1 | IC1.24 66.69,49.76 66.67,52.07 67.94,54.61 v67.94,62.23 | STEER_POT.3 36.2,74.93 | 36.2,74.93 STEER_POT.4 | R2.1 43.69,74.93 41.91,74.93 | 36.2,74.93 41.91,74.93 | 41.91,74.93 R4.2 41.91,71.75 43.18,70.48 C6.1 | C6.1 43.81,70.48
  Bottom 0.406: v61.16,62.23 v67.94,62.23

### Text on the board
Top: 2008 | orbswarm.com | SWARM | V2rev0
tNames: PT78HT205V
_tsilk: AGGREGATOR | STEER_POT | IMU | C14 | C2 | STEER_TRIM | C10 | R4 | R2 | C22 | C18 | C13 | C9 | C12 | C6 | C8 | C1 | SPU_COM2 | R11 | C23 | R10 | R9 | 10K | ENCODER | 1K | SPU_COM3 | SPU +5V | C4 | C16 | C11 | PT78HT205V | SPU_LCD | ICSP | L1 | RESET | R8 | COM5_RS232 | C15 | HEARTBEAT | R5 | C17 | C5 | C3 | +12V | +12V | +5V | GND | SPU_DIO | R1 | GND | R3 | 510 | D1 | 12V_OK | C19 | 1K | +5V | C24 | R6 | 1k | C20 | R7 | C21 | C7 | COM4_RS232 | H-BRIDGE